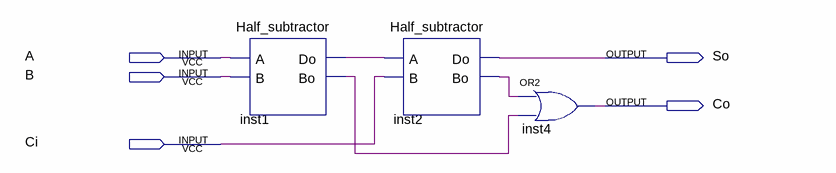
[diagram p0: schematic sheet]
// Quartus schematic Full_subtractor.bdf as structural Verilog: 3 symbols, 5 pins
module Full_subtractor (
  input  A,
  input  B,
  input  Ci,
  output So,
  output Co
);

  wire inst1_bo, inst1_do, inst2_bo;

  Half_subtractor inst1 (.A(A), .B(B), .Do(inst1_do), .Bo(inst1_bo));
  Half_subtractor inst2 (.A(inst1_do), .B(Ci), .Do(So), .Bo(inst2_bo));
  or inst4 (Co, inst2_bo, inst1_bo);
endmodule
